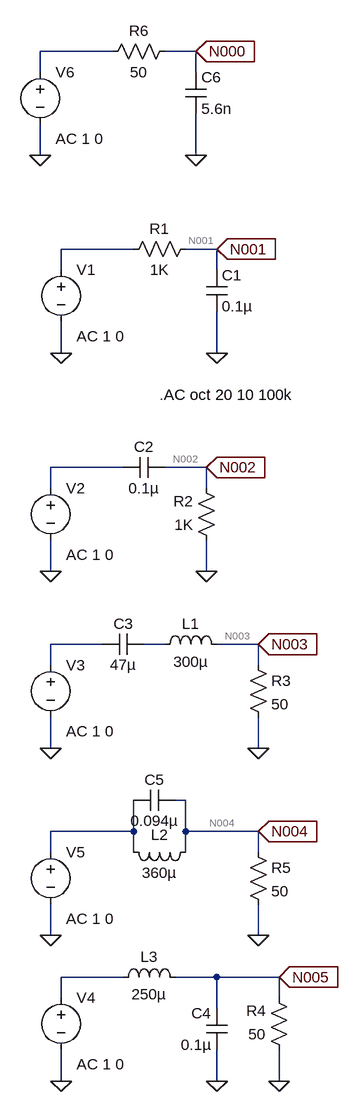
[diagram p0: schematic LTspice_sim.asc]
LTspice_sim.asc, the LTspice schematic file:
Version 4
SHEET 1 880 1652
WIRE 176 -64 64 -64
WIRE 304 -64 256 -64
WIRE 64 -32 64 -64
WIRE 304 -32 304 -64
WIRE 64 96 64 48
WIRE 304 96 304 32
WIRE 208 240 96 240
WIRE 336 240 288 240
WIRE 96 272 96 240
WIRE 336 272 336 240
WIRE 96 400 96 352
WIRE 336 400 336 336
WIRE 192 576 80 576
WIRE 320 576 256 576
WIRE 80 608 80 576
WIRE 320 608 320 576
WIRE 80 736 80 688
WIRE 320 736 320 688
WIRE 160 848 80 848
WIRE 256 848 224 848
WIRE 400 848 336 848
WIRE 80 880 80 848
WIRE 400 880 400 848
WIRE 80 1008 80 960
WIRE 400 1008 400 960
WIRE 288 1088 272 1088
WIRE 208 1136 208 1088
WIRE 208 1136 80 1136
WIRE 288 1136 288 1088
WIRE 400 1136 288 1136
WIRE 80 1168 80 1136
WIRE 208 1168 208 1136
WIRE 288 1168 288 1136
WIRE 400 1168 400 1136
WIRE 80 1296 80 1248
WIRE 400 1296 400 1248
WIRE 192 1360 96 1360
WIRE 336 1360 272 1360
WIRE 432 1360 336 1360
WIRE 96 1392 96 1360
WIRE 432 1392 432 1360
WIRE 336 1408 336 1360
WIRE 96 1520 96 1472
WIRE 336 1520 336 1472
WIRE 432 1520 432 1472
FLAG 336 240 N001
IOPIN 336 240 In
FLAG 96 400 0
FLAG 336 400 0
FLAG 320 576 N002
IOPIN 320 576 In
FLAG 80 736 0
FLAG 320 736 0
FLAG 400 848 N003
IOPIN 400 848 In
FLAG 80 1008 0
FLAG 400 1008 0
FLAG 400 1136 N004
IOPIN 400 1136 In
FLAG 80 1296 0
FLAG 400 1296 0
FLAG 432 1360 N005
IOPIN 432 1360 In
FLAG 96 1520 0
FLAG 432 1520 0
FLAG 336 1520 0
FLAG 304 -64 N000
IOPIN 304 -64 In
FLAG 64 96 0
FLAG 304 96 0
SYMBOL Res 304 224 R90
WINDOW 0 0 56 VBottom 2
WINDOW 3 32 56 VTop 2
SYMATTR InstName R1
SYMATTR Value 1K
SYMBOL cap 320 272 R0
SYMATTR InstName C1
SYMATTR Value 0.1µ
SYMATTR SpiceLine Rser=0 Lser=0 mfg="   ---" pn="   ---" type="   ---"
SYMBOL Voltage 96 256 R0
WINDOW 3 24 96 Invisible 2
WINDOW 123 24 118 Left 2
SYMATTR Value 0
SYMATTR Value2 AC 1 0
SYMATTR InstName V1
SYMBOL Res 336 704 R180
WINDOW 0 36 76 Left 2
WINDOW 3 36 40 Left 2
SYMATTR InstName R2
SYMATTR Value 1K
SYMBOL cap 256 560 R90
WINDOW 0 0 32 VBottom 2
WINDOW 3 32 32 VTop 2
SYMATTR InstName C2
SYMATTR Value 0.1µ
SYMATTR SpiceLine Rser=0 Lser=0 mfg="   ---" pn="   ---" type="   ---"
SYMBOL Voltage 80 592 R0
WINDOW 3 24 96 Invisible 2
WINDOW 123 24 118 Left 2
SYMATTR Value 0
SYMATTR Value2 AC 1 0
SYMATTR InstName V2
SYMBOL Voltage 80 864 R0
WINDOW 3 24 96 Invisible 2
WINDOW 123 24 118 Left 2
SYMATTR Value 0
SYMATTR Value2 AC 1 0
SYMATTR InstName V3
SYMBOL Cap 224 832 R90
WINDOW 0 0 32 VBottom 2
WINDOW 3 32 32 VTop 2
SYMATTR InstName C3
SYMATTR Value 47µ
SYMBOL ind 240 864 R270
WINDOW 0 32 56 VTop 2
WINDOW 3 5 56 VBottom 2
SYMATTR InstName L1
SYMATTR Value 300µ
SYMBOL Res 384 864 R0
SYMATTR InstName R3
SYMATTR Value 50
SYMBOL Voltage 80 1152 R0
WINDOW 3 24 96 Invisible 2
WINDOW 123 24 118 Left 2
SYMATTR Value 0
SYMATTR Value2 AC 1 0
SYMATTR InstName V5
SYMBOL Cap 272 1072 R90
WINDOW 0 0 32 VBottom 2
WINDOW 3 32 32 VTop 2
SYMATTR InstName C5
SYMATTR Value 0.094µ
SYMBOL ind 304 1152 R90
WINDOW 0 5 56 VBottom 2
WINDOW 3 32 56 VTop 2
SYMATTR InstName L2
SYMATTR Value 360µ
SYMBOL Res 384 1152 R0
SYMATTR InstName R5
SYMATTR Value 50
SYMBOL Res 448 1488 R180
WINDOW 0 36 76 Left 2
WINDOW 3 36 40 Left 2
SYMATTR InstName R4
SYMATTR Value 50
SYMBOL cap 352 1472 R180
WINDOW 0 24 56 Left 2
WINDOW 3 24 8 Left 2
SYMATTR InstName C4
SYMATTR Value 0.1µ
SYMATTR SpiceLine Rser=0 Lser=0 mfg="   ---" pn="   ---" type="   ---"
SYMBOL Voltage 96 1376 R0
WINDOW 3 24 96 Invisible 2
WINDOW 123 24 118 Left 2
SYMATTR Value 0
SYMATTR Value2 AC 1 0
SYMATTR InstName V4
SYMBOL ind 176 1376 R270
WINDOW 0 32 56 VTop 2
WINDOW 3 5 56 VBottom 2
SYMATTR InstName L3
SYMATTR Value 250µ
SYMBOL Res 272 -80 R90
WINDOW 0 0 56 VBottom 2
WINDOW 3 32 56 VTop 2
SYMATTR InstName R6
SYMATTR Value 50
SYMBOL cap 288 -32 R0
SYMATTR InstName C6
SYMATTR Value 5.6n
SYMATTR SpiceLine Rser=0 Lser=0 mfg="   ---" pn="   ---" type="   ---"
SYMBOL Voltage 64 -48 R0
WINDOW 3 24 96 Invisible 2
WINDOW 123 24 118 Left 2
SYMATTR Value 0
SYMATTR Value2 AC 1 0
SYMATTR InstName V6
TEXT 248 464 Left 2 !.AC oct 20 10 100k

The netlist it stands for:
* LTspice_sim.asc
R1 N001 N007 1K
C1 N001 0 0.1µ Rser=0 Lser=0 mfg="   ---" pn="   ---" type="   ---"
V1 N007 0 0 AC 1 0
R2 0 N002 1K
C2 N002 N008 0.1µ Rser=0 Lser=0 mfg="   ---" pn="   ---" type="   ---"
V2 N008 0 0 AC 1 0
V3 N009 0 0 AC 1 0
C3 N010 N009 47µ
L1 N010 N003 300µ
R3 N003 0 50
V5 N011 0 0 AC 1 0
C5 N004 N011 0.094µ
L2 N004 N011 360µ
R5 N004 0 50
R4 0 N005 50
C4 0 N005 0.1µ Rser=0 Lser=0 mfg="   ---" pn="   ---" type="   ---"
V4 N012 0 0 AC 1 0
L3 N012 N005 250µ
R6 N000 N006 50
C6 N000 0 5.6n Rser=0 Lser=0 mfg="   ---" pn="   ---" type="   ---"
V6 N006 0 0 AC 1 0
.AC oct 20 10 100k
.backanno
.end

* Results of the author's LTspice run, read from the files saved beside the schematic
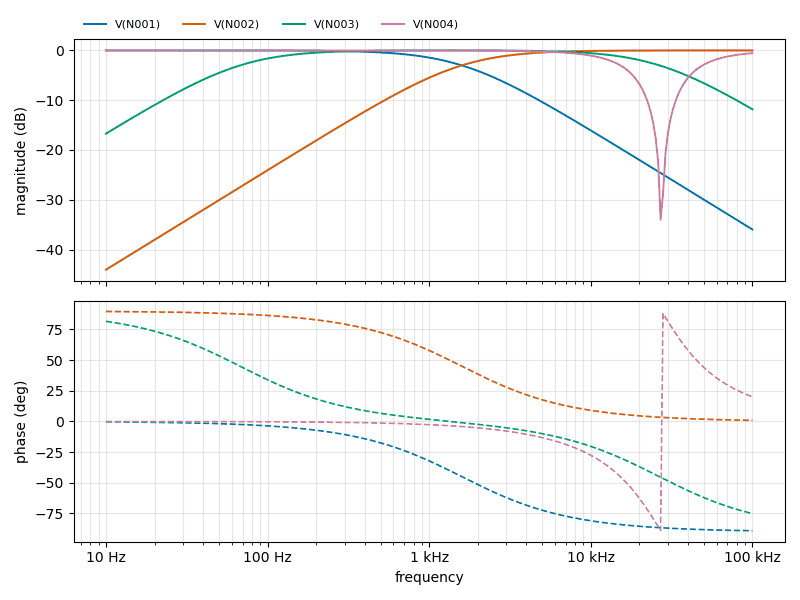
[diagram p1: AC Analysis of LTspice_sim.asc, plotted from the saved traces]
* AC Analysis, 1 run:
*   V(N001): -0.00 dB at 10 Hz, -35.96 dB at 100 kHz, peak -0.00 dB at 10 Hz, 3 dB below the peak at 1.591 kHz
*   V(N002): -44.04 dB at 10 Hz, -0.00 dB at 100 kHz, peak -0.00 dB at 100 kHz, 3 dB below the peak at 1.591 kHz
*   V(N003): -16.71 dB at 10 Hz, -11.82 dB at 100 kHz, peak -0.00 dB at 1.325 kHz, 3 dB below the peak at 67.56 Hz and 26.59 kHz
*   V(N004): -0.00 dB at 10 Hz, -0.55 dB at 100 kHz, peak -0.00 dB at 10 Hz, 3 dB below the peak at 15.24 kHz